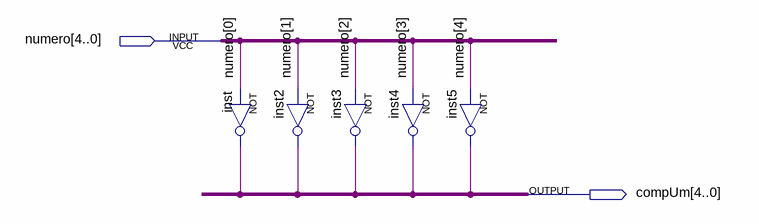
[diagram p0: schematic sheet]
// Quartus schematic complementoUm.bdf as structural Verilog: 5 symbols, 2 pins
module complementoUm (
  input  [4:0] numero,
  output [4:0] compUm
);

  wire inst2_out, inst3_out, inst4_out, inst5_out, inst_out;

  not inst (inst_out, numero[0]);
  not inst2 (inst2_out, numero[1]);
  not inst3 (inst3_out, numero[2]);
  not inst4 (inst4_out, numero[3]);
  not inst5 (inst5_out, numero[4]);
endmodule
